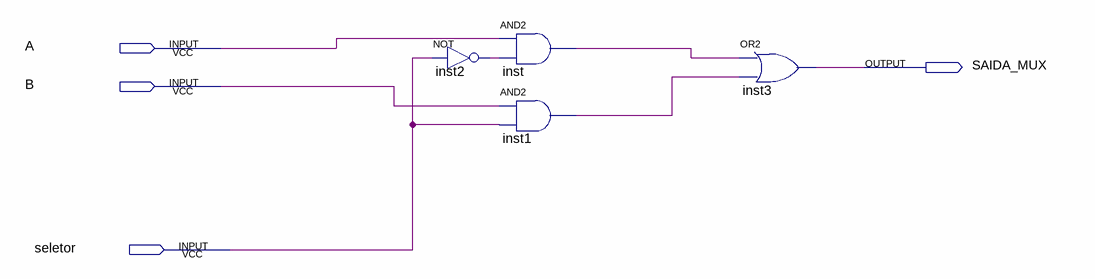
[diagram p0: schematic sheet]
// Quartus schematic MUX1BIT.bdf as structural Verilog: 4 symbols, 4 pins
module MUX1BIT (
  input  A,
  input  B,
  input  seletor,
  output SAIDA_MUX
);

  wire inst1_out, inst2_out, inst_out;

  not inst2 (inst2_out, seletor);
  and inst (inst_out, A, inst2_out);
  and inst1 (inst1_out, B, seletor);
  or inst3 (SAIDA_MUX, inst_out, inst1_out);
endmodule
